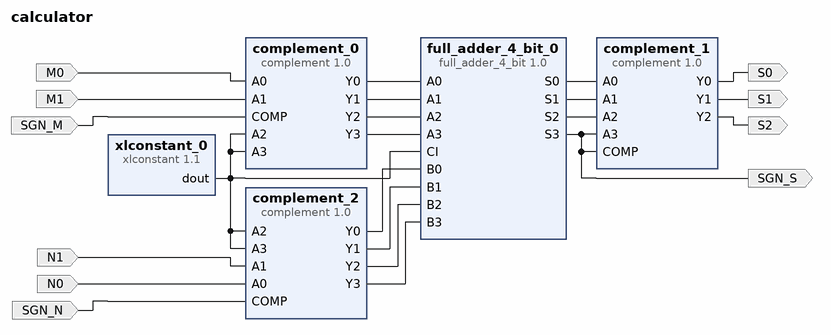
[diagram p0: block diagram of the top level]
# Vivado block design calculator, xc7a35tcpg236-1, Vivado 2016.3
create_bd_design calculator

create_bd_port -dir I M0
create_bd_port -dir I M1
create_bd_port -dir I SGN_M
create_bd_port -dir I N1
create_bd_port -dir I N0
create_bd_port -dir I SGN_N
create_bd_port -dir O SGN_S
create_bd_port -dir O S0
create_bd_port -dir O S1
create_bd_port -dir O S2

create_bd_cell -type ip -vlnv xilinx.com:user:full_adder_4_bit:1.0 full_adder_4_bit_0
create_bd_cell -type ip -vlnv xilinx.com:ip:xlconstant:1.1 xlconstant_0
set_property -dict {CONFIG.CONST_VAL 0} [get_bd_cells xlconstant_0]
create_bd_cell -type ip -vlnv xilinx.com:user:complement:1.0 complement_0
create_bd_cell -type ip -vlnv xilinx.com:user:complement:1.0 complement_1
create_bd_cell -type ip -vlnv xilinx.com:user:complement:1.0 complement_2

# ---- connections ----

connect_bd_net -net M0_1 [get_bd_ports M0] [get_bd_pins complement_0/A0]
connect_bd_net -net M1_1 [get_bd_ports M1] [get_bd_pins complement_0/A1]
connect_bd_net [get_bd_ports SGN_M] [get_bd_pins complement_0/COMP]
connect_bd_net [get_bd_pins xlconstant_0/dout] \
  [get_bd_pins full_adder_4_bit_0/CI] [get_bd_pins complement_0/A2] [get_bd_pins complement_0/A3] \
  [get_bd_pins complement_2/A2] [get_bd_pins complement_2/A3]
connect_bd_net -net N1_1 [get_bd_ports N1] [get_bd_pins complement_2/A1]
connect_bd_net -net N0_1 [get_bd_ports N0] [get_bd_pins complement_2/A0]
connect_bd_net [get_bd_ports SGN_N] [get_bd_pins complement_2/COMP]
connect_bd_net [get_bd_pins complement_0/Y0] [get_bd_pins full_adder_4_bit_0/A0]
connect_bd_net [get_bd_pins complement_0/Y1] [get_bd_pins full_adder_4_bit_0/A1]
connect_bd_net [get_bd_pins complement_0/Y2] [get_bd_pins full_adder_4_bit_0/A2]
connect_bd_net [get_bd_pins complement_0/Y3] [get_bd_pins full_adder_4_bit_0/A3]
connect_bd_net [get_bd_pins complement_2/Y0] [get_bd_pins full_adder_4_bit_0/B0]
connect_bd_net [get_bd_pins complement_2/Y1] [get_bd_pins full_adder_4_bit_0/B1]
connect_bd_net [get_bd_pins complement_2/Y2] [get_bd_pins full_adder_4_bit_0/B2]
connect_bd_net [get_bd_pins complement_2/Y3] [get_bd_pins full_adder_4_bit_0/B3]
connect_bd_net [get_bd_pins full_adder_4_bit_0/S0] [get_bd_pins complement_1/A0]
connect_bd_net [get_bd_pins full_adder_4_bit_0/S1] [get_bd_pins complement_1/A1]
connect_bd_net [get_bd_pins full_adder_4_bit_0/S2] [get_bd_pins complement_1/A2]
connect_bd_net [get_bd_pins full_adder_4_bit_0/S3] [get_bd_ports SGN_S] [get_bd_pins complement_1/A3] [get_bd_pins complement_1/COMP]
connect_bd_net [get_bd_pins complement_1/Y0] [get_bd_ports S0]
connect_bd_net [get_bd_pins complement_1/Y1] [get_bd_ports S1]
connect_bd_net [get_bd_pins complement_1/Y2] [get_bd_ports S2]

validate_bd_design
save_bd_design
